# EAGLE schematic StepperCtrl (EAGLE 4.16)
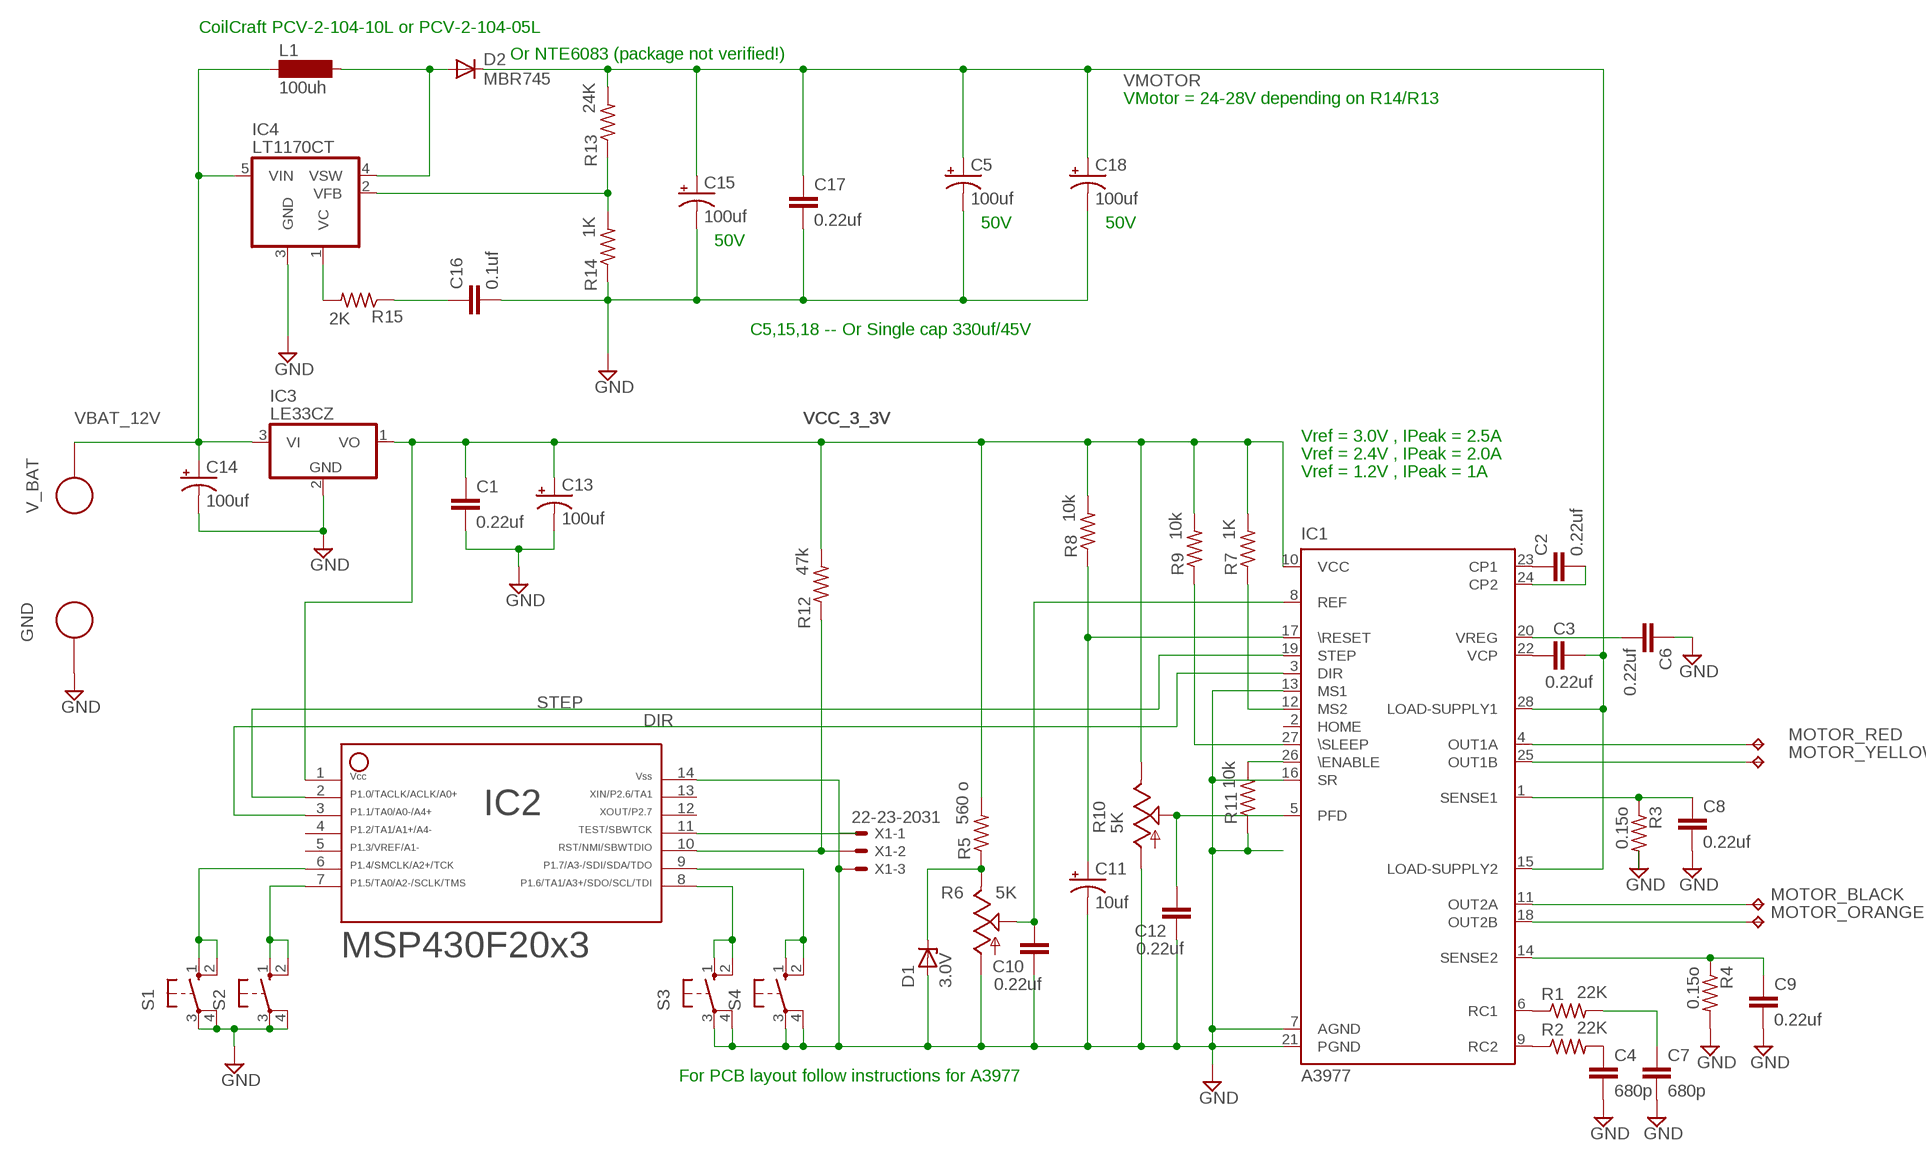
[diagram p0: schematic, sheet 1]

## Parts
C1  0.22uf  C-EUC0805  [C0805]
C2  0.22uf  C-EUC0805  [C0805]
C3  0.22uf  C-EUC0805  [C0805]
C4  680p  C-EUC0805  [C0805]
C5  100uf  CPOL-USE22-9AXIAL  [E22-9]
C6  0.22uf  C-EUC0805  [C0805]
C7  680p  C-EUC0805  [C0805]
C8  0.22uf  C-EUC0805  [C0805]
C9  0.22uf  C-EUC0805  [C0805]
C10  0.22uf  C-EUC0805  [C0805]
C11  10uf  CPOL-USE22-9AXIAL  [E22-9]
C12  0.22uf  C-EUC0805  [C0805]
C13  100uf  CPOL-USE22-9AXIAL  [E22-9]
C14  100uf  CPOL-USE22-9AXIAL  [E22-9]
C15  100uf  CPOL-USE22-9AXIAL  [E22-9]
C16  0.1uf  C-EUC0805  [C0805]
C17  0.22uf  C-EUC0805  [C0805]
C18  100uf  CPOL-USE22-9AXIAL  [E22-9]
D1  3.0V  ZENER-DIODEDO35Z10  [DO35Z10]
D2  MBR745  MBR750  [TO220AC]
GND  TP_1TPAD_300  [PAD_1]
IC1  A3977  [TSSOP28]
IC2  F20X3---PW14  [PW14]
IC3  LE33CZ  [TO92-]
IC4  LT1170CT  [TO220-5]
L1  100uh  SD12  [COILCRAFTPCV2]
MOTOR_BLACK  TPPAD1-20  [P1-20]
MOTOR_ORANGE  TPPAD1-20  [P1-20]
MOTOR_RED  TPPAD1-20  [P1-20]
MOTOR_YELLOW  TPPAD1-20  [P1-20]
R1  22K  R-US_M0805  [M0805]
R2  22K  R-US_M0805  [M0805]
R3  0.15o  R-US_0207/2V  [0207/2V]
R4  0.15o  R-US_0207/2V  [0207/2V]
R5  560 o  R-US_M0805  [M0805]
R6  5K  TRIM_US-CA6H  [CA6H]
R7  1K  R-US_M0805  [M0805]
R8  10k  R-US_M0805  [M0805]
R9  10k  R-US_M0805  [M0805]
R10  5K  TRIM_US-CA6H  [CA6H]
R11  10k  R-US_M0805  [M0805]
R12  47k  R-US_M0805  [M0805]
R13  24K  R-US_M0805  [M0805]
R14  1K  R-US_M0805  [M0805]
R15  2K  R-US_M0805  [M0805]
S1  10-XX  [B3F-10XX]
S2  10-XX  [B3F-10XX]
S3  10-XX  [B3F-10XX]
S4  10-XX  [B3F-10XX]
V_BAT  TP_1TPAD_300  [PAD_1]
X1  22-23-2031  [22-23-2031]

## Nets
DIR: IC1.3(DIR) IC2.3
GND: C1.2 C4.2 C5.- C6.1 C7.2 C8.2 C9.2 C10.1 C12.1 C13.- C14.- C15.- C16.2 C17.2 C18.- D1.A GND.P$1 IC1.7(AGND) IC1.13(MS1) IC1.16(SR) IC1.21(PGND) IC2.14 IC3.2(GND) IC4.3(GND) R3.2 R4.2 R6.A R10.A R11.1 R14.1 S1.3(P) S1.4(P1) S2.3(P) S2.4(P1) S3.3(P) S3.4(P1) S4.3(P) S4.4(P1) X1.3
N$1: C2.1 IC1.23(CP1)
N$2: C3.2 IC1.22(VCP)
N$3: IC1.6(RC1) R1.1
N$4: C2.2 IC1.24(CP2)
N$5: C6.2 IC1.20(VREG)
N$6: IC1.9(RC2) R2.1
N$7: C4.1 R2.2
N$8: C7.1 R1.2
N$9: C8.1 IC1.1(SENSE1) R3.1
N$10: C9.1 IC1.14(SENSE2) R4.1
N$11: D1.C R5.1 R6.E
N$12: IC1.11(OUT2A) MOTOR_BLACK.1(TP)
N$13: IC1.12(MS2) R7.1
N$14: C10.2 IC1.8(REF) R6.S
N$15: C11.+ IC1.17(\RESET) R8.1
N$16: IC1.27(\SLEEP) R9.1
N$17: C12.2 IC1.5(PFD) R10.S
N$18: IC2.11 X1.1
N$19: IC1.26(\ENABLE) R11.2
N$20: IC2.10 R12.1 X1.2
N$21: IC1.18(OUT2B) MOTOR_ORANGE.1(TP)
N$22: IC1.4(OUT1A) MOTOR_RED.1(TP)
N$23: IC1.25(OUT1B) MOTOR_YELLOW.1(TP)
N$24: IC2.6 S1.1(S) S1.2(S1)
N$25: IC2.7 S2.1(S) S2.2(S1)
N$26: IC2.9 S4.1(S) S4.2(S1)
N$27: C11.-
N$28: IC2.8 S3.1(S) S3.2(S1)
N$29: D2.A IC4.4(VSW) L1.P$2
N$31: IC4.1(VC) R15.2
N$32: C16.1 R15.1
N$34: IC4.2(VFB) R13.1 R14.2
STEP: IC1.19(STEP) IC2.2
VBAT_12V: C14.+ IC3.3(VI) IC4.5(VIN) L1.P$1 V_BAT.P$1
VCC_3_3V: C1.1 C13.+ IC1.10(VCC) IC2.1 IC3.1(VO) R5.2 R7.2 R8.2 R9.2 R10.E R12.2
VMOTOR: C3.1 C5.+ C15.+ C17.1 C18.+ D2.C IC1.15(LOAD-SUPPLY2) IC1.28(LOAD-SUPPLY1) R13.2
Unconnected: IC1.2(HOME) IC2.4 IC2.5 IC2.12 IC2.13

## Notes on the sheet
- CoilCraft PCV-2-104-10L or PCV-2-104-05L
- Or NTE6083 (package not verified!)
- VMotor = 24-28V depending on R14/R13
- 50V | 50V
- 50V
- C5,15,18 -- Or Single cap 330uf/45V
- Vref = 3.0V , IPeak = 2.5A
- Vref = 2.4V , IPeak = 2.0A
- Vref = 1.2V , IPeak = 1A
- For PCB layout follow instructions for A3977

## Library data of the parts
C1-C4 C6-C10 C12 C16 C17 = rcl:C-EU: CAPACITOR, European symbol
C5 C11 C13-C15 C18 = rcl:CPOL-US: POLARIZED CAPACITOR, American symbol
D1 = diode:ZENER-DIODE: Z-Diode
D2 = diode:MBR750: DIODE barrier rectifier, 7.5 A, 50 V
GND V_BAT = ZStofer:TP_1
IC1 = Stofer:A3977: MICROSTEPPING DMOS DRIVER WITH TRANSLATOR Source: 3977.pdf
IC2 = TI_MSP430_v12:F20X3---PW14: ***MSP430F20x3***PW14
IC3 = ZStofer:LE33CZ
IC4 = ZStofer:LT1170: Switching Regulator
L1 = ZStofer:SD12: INDUCTOR nominal inductance
MOTOR_BLACK MOTOR_ORANGE MOTOR_RED MOTOR_YELLOW = ZStofer:TP
R1-R5 R7-R9 R11-R15 = rcl:R-US_: RESISTOR, American symbol
R6 R10 = pot:TRIM_US-: POTENTIOMETER
S1-S4 = switch-omron:10-XX: OMRON SWITCH
X1 = con-molex:22-23-2031: .100" (2.54mm) Center Header - 3 Pin